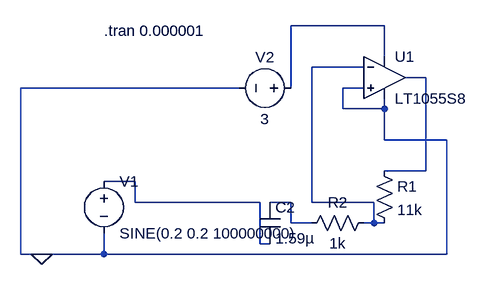
[diagram p0: schematic RFamplifier.asc]
RFamplifier.asc, the LTspice schematic file:
Version 4
SHEET 1 948 680
WIRE 816 112 672 112
WIRE 816 160 816 112
WIRE 784 176 704 176
WIRE 880 192 848 192
WIRE 592 208 256 208
WIRE 672 208 672 112
WIRE 784 208 752 208
WIRE 752 240 752 208
WIRE 816 240 816 224
WIRE 816 240 752 240
WIRE 816 288 816 240
WIRE 912 288 816 288
WIRE 880 336 880 192
WIRE 880 336 816 336
WIRE 432 352 384 352
WIRE 432 384 432 352
WIRE 624 384 432 384
WIRE 672 384 640 384
WIRE 704 384 704 176
WIRE 800 384 704 384
WIRE 672 416 672 384
WIRE 704 416 672 416
WIRE 800 416 800 384
WIRE 800 416 784 416
WIRE 816 416 800 416
WIRE 624 448 624 384
WIRE 640 448 624 448
WIRE 256 464 256 208
WIRE 288 464 256 464
WIRE 384 464 384 432
WIRE 384 464 288 464
WIRE 912 464 912 288
WIRE 912 464 384 464
FLAG 288 464 0
SYMBOL voltage 384 336 R0
SYMATTR InstName V1
SYMATTR Value SINE(0.2 0.2 100000000)
SYMBOL voltage 688 208 R90
WINDOW 0 -32 56 VBottom 2
WINDOW 3 32 56 VTop 2
SYMATTR InstName V2
SYMATTR Value 3
SYMBOL res 800 320 R0
SYMATTR InstName R1
SYMATTR Value 11k
SYMBOL res 800 400 R90
WINDOW 0 0 56 VBottom 2
WINDOW 3 32 56 VTop 2
SYMATTR InstName R2
SYMATTR Value 1k
SYMBOL Opamps/LT1055S8 816 128 R0
SYMATTR InstName U1
SYMBOL cap 624 384 R0
SYMATTR InstName C2
SYMATTR Value 1.59µ
TEXT 384 120 Left 2 !.tran 0.000001

The netlist it stands for:
* RFamplifier.asc
V1 N004 0 SINE(0.2 0.2 100000000)
V2 N001 0 3
R1 N003 N002 11k
R2 N002 N005 1k
XU1 0 N002 N001 0 N003 LT1055S8  ; pins In+ In- V+ V- OUT
C2 N005 N004 1.59µ
.tran 0.000001
.backanno
.end